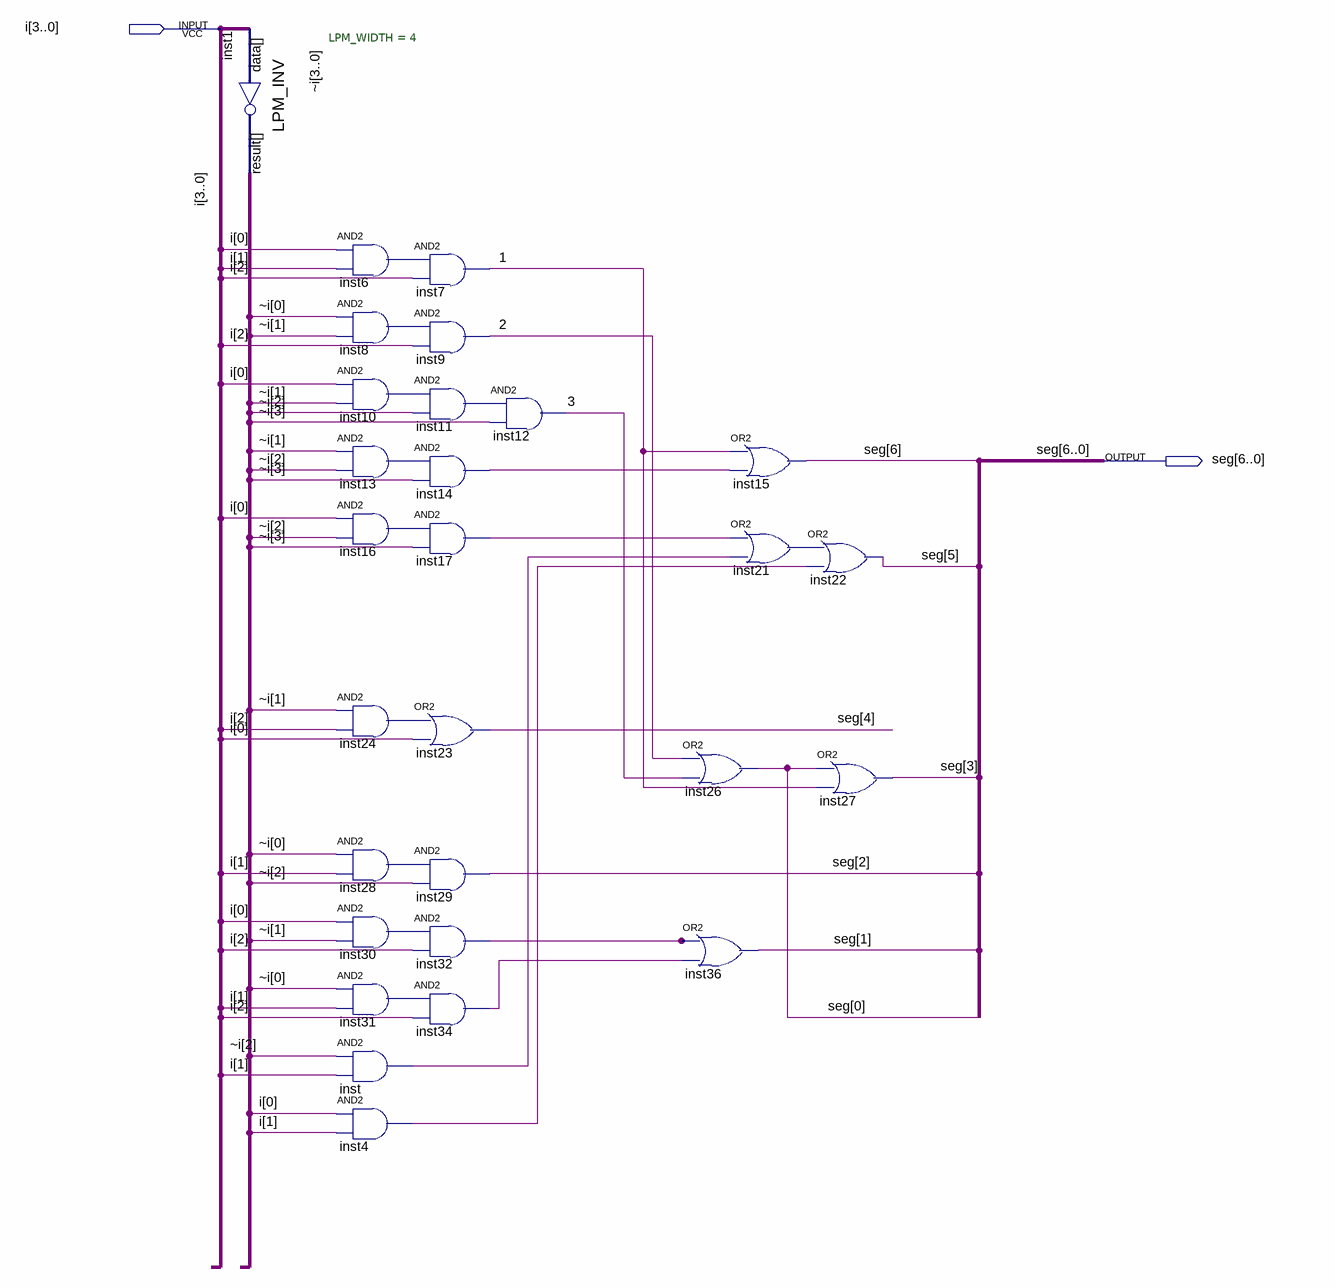
[diagram p0: schematic sheet]
// Quartus schematic test.bdf as structural Verilog: 28 symbols, 2 pins
module test (
  input  [3:0] i,
  output [6:0] seg
);

  wire \1 , \2 , \3 , inst4_out, inst6_out, inst8_out, inst10_out, inst11_out, inst13_out, inst14_out,
       inst16_out, inst17_out, inst21_out, inst24_out, inst28_out, inst30_out, inst31_out, inst32_out,
       inst34_out, inst_out;
  wire [3:0] \~i ;

  LPM_INV #(.LPM_WIDTH(4)) inst1 (.data(i), .result(\~i ));
  and inst6 (inst6_out, i[0], i[1]);
  and inst8 (inst8_out, \~i [0], \~i [1]);
  and inst10 (inst10_out, i[0], \~i [1]);
  and inst13 (inst13_out, \~i [1], \~i [2]);
  and inst16 (inst16_out, i[0], \~i [2]);
  and inst24 (inst24_out, \~i [1], i[2]);
  and inst28 (inst28_out, \~i [0], i[1]);
  and inst30 (inst30_out, i[0], \~i [1]);
  and inst31 (inst31_out, \~i [0], i[1]);
  and inst (inst_out, \~i [2], i[1]);
  and inst4 (inst4_out, i[0], i[1]);
  and inst7 (\1 , inst6_out, i[2]);
  and inst9 (\2 , inst8_out, i[2]);
  and inst11 (inst11_out, inst10_out, \~i [2]);
  and inst14 (inst14_out, inst13_out, \~i [3]);
  and inst17 (inst17_out, inst16_out, \~i [3]);
  or inst23 (seg[4], inst24_out, i[0]);
  and inst29 (seg[2], inst28_out, \~i [2]);
  and inst32 (inst32_out, inst30_out, i[2]);
  and inst34 (inst34_out, inst31_out, i[2]);
  and inst12 (\3 , inst11_out, \~i [3]);
  or inst15 (seg[6], \1 , inst14_out);
  or inst21 (inst21_out, inst17_out, inst_out);
  or inst26 (seg[0], \2 , \3 );
  or inst36 (seg[1], inst32_out, inst34_out);
  or inst22 (seg[5], inst21_out, inst4_out);
  or inst27 (seg[3], seg[0], \1 );
endmodule
